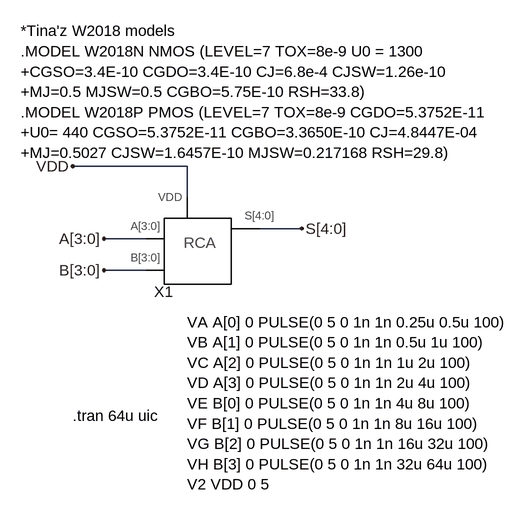
[diagram p0: schematic RCATest.asc]
RCATest.asc, the LTspice schematic file:
Version 4
SHEET 1 880 736
WIRE 240 224 64 224
WIRE 240 272 240 224
WIRE 416 320 352 320
WIRE 176 336 112 336
WIRE 176 384 112 384
FLAG 64 224 VDD
FLAG 416 320 S[4:0]
FLAG 112 336 A[3:0]
FLAG 112 384 B[3:0]
SYMBOL RCA4bit 240 320 R0
SYMATTR InstName X1
TEXT -16 16 Left 2 !*Tina'z W2018 models\n.MODEL W2018N NMOS (LEVEL=7 TOX=8e-9 U0 = 1300\n+CGSO=3.4E-10 CGDO=3.4E-10 CJ=6.8e-4 CJSW=1.26e-10\n+MJ=0.5 MJSW=0.5 CGBO=5.75E-10 RSH=33.8)\n.MODEL W2018P PMOS (LEVEL=7 TOX=8e-9 CGDO=5.3752E-11\n+U0= 440 CGSO=5.3752E-11 CGBO=3.3650E-10 CJ=4.8447E-04\n+MJ=0.5027 CJSW=1.6457E-10 MJSW=0.217168 RSH=29.8)
TEXT 240 464 Left 2 !VA A[0] 0 PULSE(0 5 0 1n 1n 0.25u 0.5u 100)\nVB A[1] 0 PULSE(0 5 0 1n 1n 0.5u 1u 100)\nVC A[2] 0 PULSE(0 5 0 1n 1n 1u 2u 100)\nVD A[3] 0 PULSE(0 5 0 1n 1n 2u 4u 100)\nVE B[0] 0 PULSE(0 5 0 1n 1n 4u 8u 100)\nVF B[1] 0 PULSE(0 5 0 1n 1n 8u 16u 100)\nVG B[2] 0 PULSE(0 5 0 1n 1n 16u 32u 100)\nVH B[3] 0 PULSE(0 5 0 1n 1n 32u 64u 100)\nV2 VDD 0 5
TEXT 64 608 Left 2 !.tran 64u uic

The netlist it stands for:
* RCATest.asc
XX1 A[3] A[2] A[1] A[0] B[3] B[2] B[1] B[0] VDD S[4] S[3] S[2] S[1] S[0] RCA4bit  ; pins A[3:0] B[3:0] VDD S[4:0]
*Tina'z W2018 models
.MODEL W2018N NMOS (LEVEL=7 TOX=8e-9 U0 = 1300
+CGSO=3.4E-10 CGDO=3.4E-10 CJ=6.8e-4 CJSW=1.26e-10
+MJ=0.5 MJSW=0.5 CGBO=5.75E-10 RSH=33.8)
.MODEL W2018P PMOS (LEVEL=7 TOX=8e-9 CGDO=5.3752E-11
+U0= 440 CGSO=5.3752E-11 CGBO=3.3650E-10 CJ=4.8447E-04
+MJ=0.5027 CJSW=1.6457E-10 MJSW=0.217168 RSH=29.8)
VA A[0] 0 PULSE(0 5 0 1n 1n 0.25u 0.5u 100)
VB A[1] 0 PULSE(0 5 0 1n 1n 0.5u 1u 100)
VC A[2] 0 PULSE(0 5 0 1n 1n 1u 2u 100)
VD A[3] 0 PULSE(0 5 0 1n 1n 2u 4u 100)
VE B[0] 0 PULSE(0 5 0 1n 1n 4u 8u 100)
VF B[1] 0 PULSE(0 5 0 1n 1n 8u 16u 100)
VG B[2] 0 PULSE(0 5 0 1n 1n 16u 32u 100)
VH B[3] 0 PULSE(0 5 0 1n 1n 32u 64u 100)
V2 VDD 0 5
.tran 64u uic
.backanno
.end